# EAGLE design LHRadioBoard (EAGLE 9.2.2)
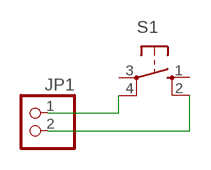
[diagram p0: schematic, sheet 1]

## Parts
JP1  PINHD-1X2  [1X02]
S1  10-XX  [B3F-10XX]

## Nets
N$1: JP1.1 S1.4(P1)
N$2: JP1.2 S1.2(S1)
Unconnected: S1.1(S) S1.3(P)

## Library data of the parts
JP1 = pinhead:PINHD-1X2: PIN HEADER
S1 = switch-omron:10-XX: OMRON SWITCH; MPN: B3F-1000; OC_FARNELL: 176432; OC_NEWARK: 36M3542

## Net classes
0 default: width 0.254 mm, clearance 0.203 mm

## Board
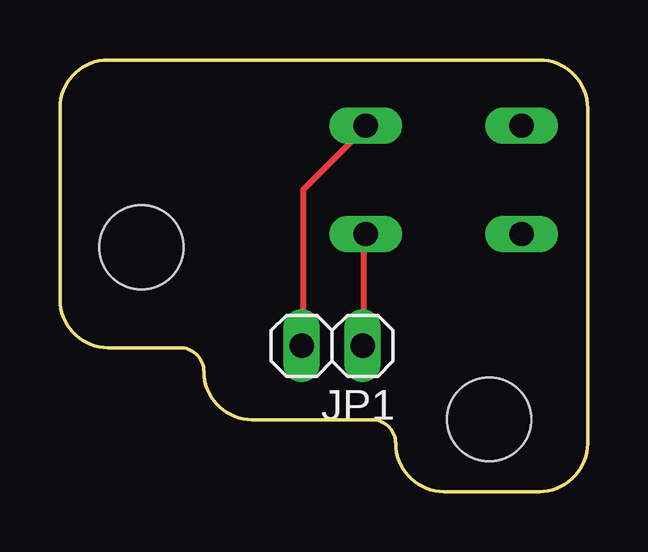
[diagram p1: board, top side]
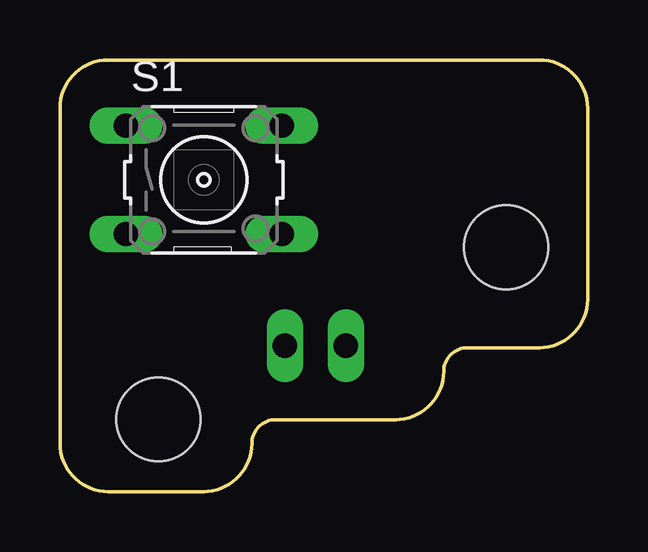
[diagram p2: board, bottom side, seen from below]

Size 22 x 18 mm. Coordinates in mm from the lower left corner, seen from the top.
Outline: 0,16 0,8 arc90 2,6 5,6 arc-90 6,5 arc90 8,3 13,3 arc-90 14,2 arc90 16,0 20,0 arc90 22,2 22,16 arc90 20,18 2,18 arc90 0,16
Copper layers (1*16): Top 0.035mm / dielectric 1.5mm / Bottom 0.035mm
Design rules "default": minimum track width 6mil, minimum drill 0.35mm, track to track 6mil, track to pad 6mil, pad to pad 6mil, via to via 6mil, smd to smd 6mil, copper to edge 40mil, drill to drill 6mil, minimum pad ring 10mil, minimum via ring 8mil, stop-mask expansion 4mil, vias tented up to drill 0mil, thermal gap 10mil
Holes 3.5 mm at 3.4,10.18 17.89,3.01

### Footprints (pad centres in the part's own frame; a part is rotated, then mirrored left to right if it is on the bottom)
1X02 = drill 1.016 long: 1 -1.27,0; 2 1.27,0
B3F-10XX = drill 1.016 long: 1 -3.251,2.261; 2 3.251,2.261; 3 -3.251,-2.261; 4 3.251,-2.261

### Placement (x,y rotation side)
JP1  11.35,6.08 180 top
S1  16,13 0 bottom

### Tracks (layer width: path | path; a pad name or v marks a point on that pad's centre or on a via)
N$1
  Top 0.254: JP1.1 12.66,6.17 12.66,10.52 S1.4
N$2
  Top 0.254: JP1.2 10.14,6.17 10.14,12.57 12.66,15.09 S1.2